# EasyEDA Pro project uven2-mk3-lid-switch-A.eprj

# Schematic Schematic1
Board Name: Board1; Create Date: 2025-08-17; Page Name: P1; Project Name: uven2-mk3-lid-switch; Schematic Name: Schematic1; Update Date: 2025-08-17; Company: EasyEDA.com; Page Size: A4; Version: V1.0
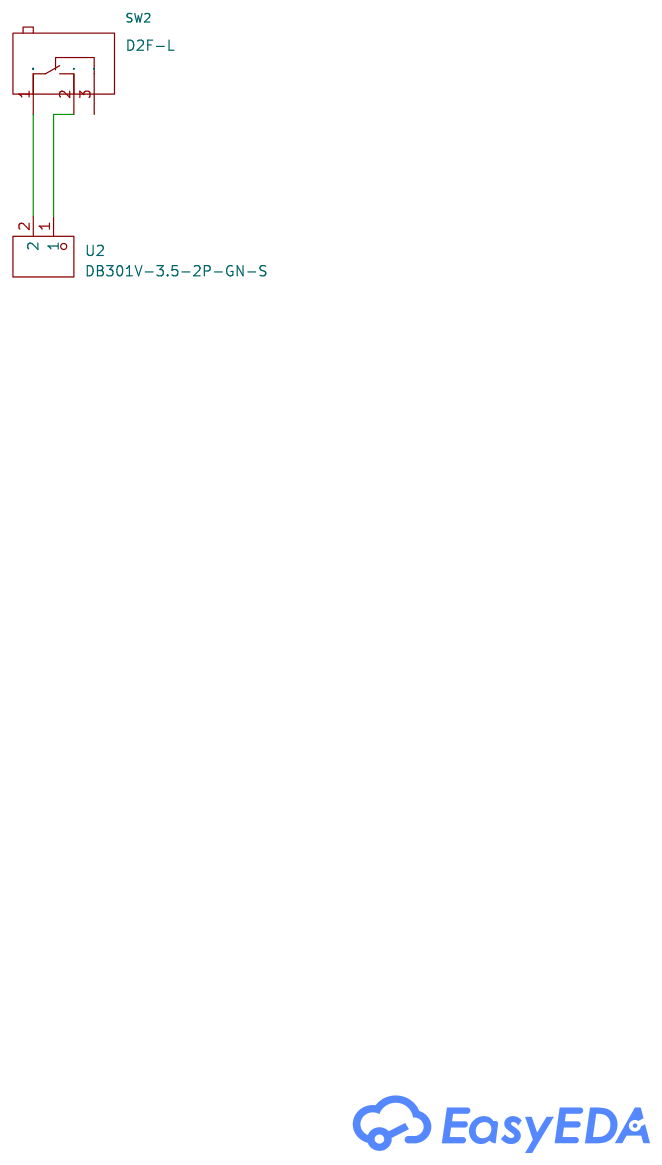
[diagram p0: schematic sheet]

## Parts
SW2  D2F-L  [SW-TH_D2F-L]
U2  DB301V-3.5-2P-GN-S  [CONN-TH_DB301V-3.5-2P-GN]

## Library data of the parts
SW2 = D2F-L_C231337: Circuit:Single Pole Double Throw (SPDT) Current Rating (DC):- Voltage Rating (DC):- Current Rating (AC):3A Voltage Rating (AC):125V Life:-; LCSC Part Name: 150gf 3A; Supplier Part: C231337; Manufacturer: OMRON(欧姆龙); Supplier Footprint: 插件; JLCPCB Part Class: Extended Part; Datasheet: https://item.szlcsc.com/datasheet/D2F-L/231224.html; Supplier: LCSC; Circuit: Single Pole Double Throw (SPDT); Current Rating (AC): 3A; Voltage Rating (AC): 125V
U2 = DB301V-3.5-2P-GN-S: Number of Positions or Pins:1x2P Pitch:3.5mm Color:Green Mounting Type:Through Hole Number of Pins:2P Number of Rows:1 Number of PINs Per Row:2 Screw Specification:M2 Current Rating:7A Voltage Rating (Max):300V Wire Gauge - AWG:- Wire Gauge - AWG:- Wire G; LCSC Part Name: 1x2P 3.5mm 直插 排数:1 每排P数:2; Supplier Part: C695629; Manufacturer: DORABO(地博电气); Supplier Footprint: 插件,P=3.5mm; JLCPCB Part Class: Extended Part; Datasheet: https://item.szlcsc.com/datasheet/DB301V-3.5-2P-GN-S/728965.html; Supplier: LCSC; Number of Positions or Pins: 1x2P; Pitch: 3.5mm; Color: Green; Mounting Type: Through Hole; Number of Pins: 2P; Number of Rows: 1; Number of PINs Per Row: 2; Screw Specification: M2; Current Rating: 7A; Voltage Rating (Max): 300V; Operating Temperature: -40℃~+105℃

## Nets
$1N330: SW2.1(COM) U2.2
$1N334: SW2.2(NO) U2.1

Not connected (* = marked no-connect by the designer): SW2 3(NC)

# Board PCB1
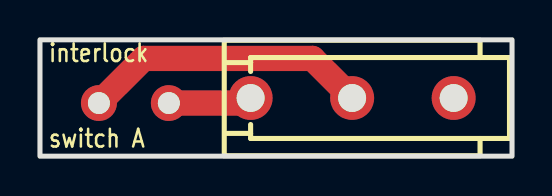
[diagram p1: board, top side]
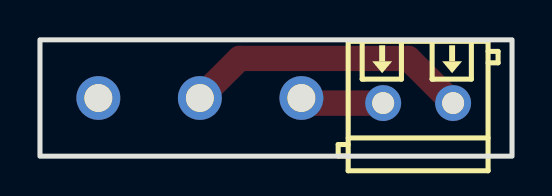
[diagram p2: board, bottom side, seen from below]

Outline 23.62 x 5.84 mm; copper layers: Top Layer, Bottom Layer. Coordinates in mm from the lower left corner of the outline.
Outline path: rectangle 0,5.84 23.62,0
Stack: Top Layer 0.035mm / Dielectric1 1.51mm FR4 er 4.5 / Bottom Layer 0.035mm

## Design rules (mm)
template: JLCPCB Capability(Two Layers Board)
spacing copperThickness1oz (default): track to track 0.102, other pairs 0.152 to 0.3
spacing copperThickness2oz: track to track 0.203, other pairs 0.152 to 0.3
track width copperThickness1oz (default): min 0.127, default 0.254, max 2.54
track width copperThickness2oz: min 0.203, default 0.254, max 2.54
differential pair differentialPair (default): width min 0.127, default 0.254, max 2.54; gap min 0.152, default 0.152
via viaSize (default): diameter min 0.5, default 0.61, max 10; hole min 0.3, default 0.305, max 6.3

## Placement (name value [footprint] x y rotation side)
SW2  D2F-L  [SW-TH_D2F-L]  15.62 2.92 0 top
U2  DB301V-3.5-2P-GN-S  [CONN-TH_DB301V-3.5-2P-GN]  4.7 2.67 0 bottom

## Footprints (pads in the part's own frame, mm; a bottom-side part is the same pattern mirrored in y, then rotated)
CONN-TH_DB301V-3.5-2P-GN
  round 1.8 hole 1.1: 1(-1.75,0) 2(1.75,0)
SW-TH_D2F-L
  round 2.2 hole 1.4: 1(-5.08,0) 2(0,0) 3(5.08,0)

## Nets
As in the schematic.

Pads without a net: SW2 3

## Routing (per net, layer and track width the routed paths; a pad name or vN(x,y) marks a point on that pad's centre or on a via; arc(x,y) is an arc through that point)
$1N330: length 4.2
  Top Layer w1.27: SW2.1 10.29,2.67 U2.2
$1N334: length 14.4
  Top Layer w1.27: SW2.2 13.63,4.91 5.19,4.91 U2.1

## Text on the board
Top Silkscreen Layer: interlock / switch A
